# Altium project Einsy_Rambo_0.4a.PrjPcb (part 2 of 2)

## Sheet Heaters.SchDoc: Heaters
size Letter; SheetNumber: 7; SheetTotal: 11
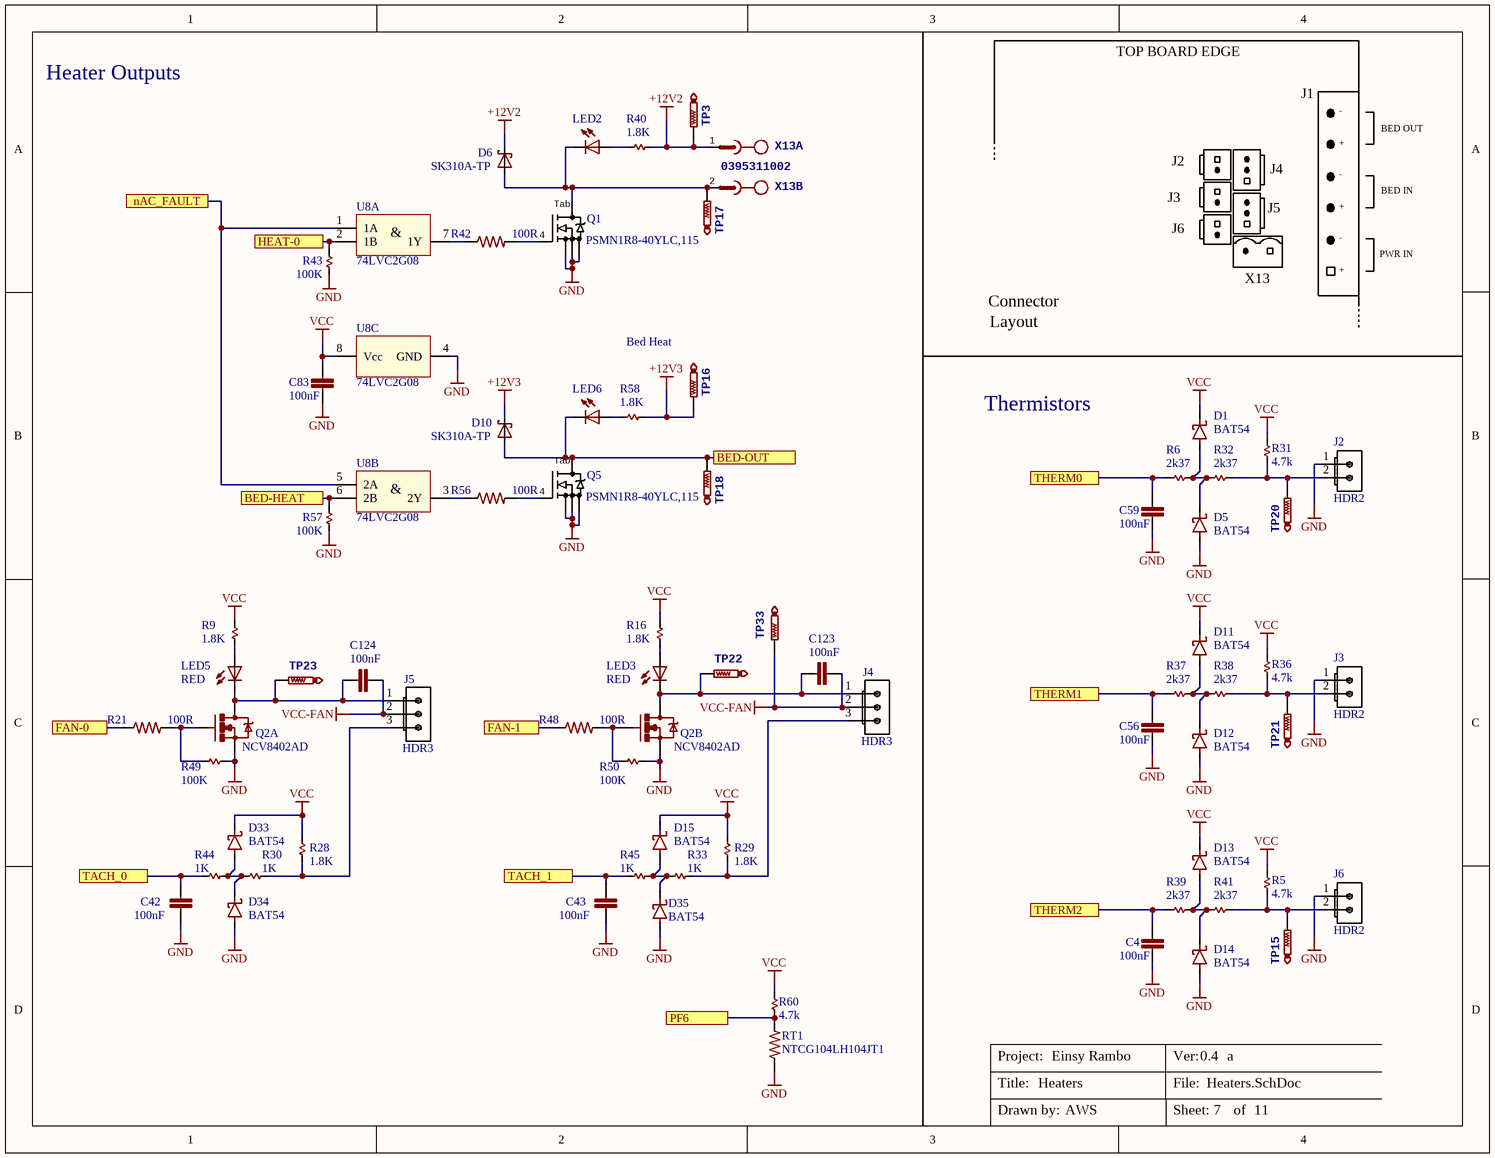
[diagram p6: Heaters.SchDoc]

### Parts
C4  100nF  [C0402]
C42  100nF  [C0402]
C43  100nF  [C0402]
C56  100nF  [C0402]
C59  100nF  [C0402]
C83  100nF  [C0402]
C123  100nF  [C0402]
C124  100nF  [C0402]
D1  BAT54  [SOD523_IPC]
D5  BAT54  [SOD523_IPC]
D6  SK310A-TP  [SMA-SM]
D10  SK310A-TP  [SMA-SM]
D11  BAT54  [SOD523_IPC]
D12  BAT54  [SOD523_IPC]
D13  BAT54  [SOD523_IPC]
D14  BAT54  [SOD523_IPC]
D15  BAT54  [SOD523_IPC]
D33  BAT54  [SOD523_IPC]
D34  BAT54  [SOD523_IPC]
D35  BAT54  [SOD523_IPC]
J2  value HDR2  [70543-02 PIN-IN-PASTE]  (hidden comment: CONN 2PIN VERT 0.1" SHRD LOCKING)
J3  value HDR2  [70543-02 PIN-IN-PASTE]  (hidden comment: CONN 2PIN VERT 0.1" SHRD LOCKING)
J4  value HDR3  [70543-03 PIN-IN-PASTE]  (hidden comment: Molex 70543-03)
J5  value HDR3  [70543-03 PIN-IN-PASTE]  (hidden comment: Molex 70543-03)
J6  value HDR2  [70543-02 PIN-IN-PASTE]  (hidden comment: CONN 2PIN VERT 0.1" SHRD LOCKING)
LED2  RED  [LED2012120]  (value not drawn)
LED3  RED  [LED2012120]
LED5  RED  [LED2012120]
LED6  RED  [LED2012120]  (value not drawn)
Q1  PSMN1R8-40YLC,115  [SOT669_ClosedBotVias]
Q2  NCV8402AD  [NCV8402AD-SOIC8]  (parts A,B of 2)
Q5  PSMN1R8-40YLC,115  [SOT669_ClosedBotVias]
R5  4.7k  [R0402]
R6  2k37  [R0402]
R9  1.8K  [R0402]
R16  1.8K  [R0402]
R21  100R  [R0402]
R28  1.8K  [R0402]
R29  1.8K  [R0402]
R30  1K  [R0402]
R31  4.7k  [R0402]
R32  2k37  [R0402]
R33  1K  [R0402]
R36  4.7k  [R0402]
R37  2k37  [R0402]
R38  2k37  [R0402]
R39  2k37  [R0402]
R40  1.8K  [R0402]
R41  2k37  [R0402]
R42  100R  [R0402]
R43  100K  [R0402]
R44  1K  [R0402]
R45  1K  [R0402]
R48  100R  [R0402]
R49  100K  [R0402]
R50  100K  [R0402]
R56  100R  [R0402]
R57  100K  [R0402]
R58  1.8K  [R0402]
R60  4.7k  [R0402]
RT1  NTCG104LH104JT1  [R0402]
TP3  TestPoint  [TP1-27]  (value not drawn)  (no BOM)
TP15  TestPoint  [TP1-27]  (value not drawn)  (no BOM)
TP16  TestPoint  [TP1-27]  (value not drawn)  (no BOM)
TP17  TestPoint  [TP1-27]  (value not drawn)  (no BOM)
TP18  TestPoint  [TP1-27]  (value not drawn)  (no BOM)
TP20  TestPoint  [TP1-27]  (value not drawn)  (no BOM)
TP21  TestPoint  [TP1-27]  (value not drawn)  (no BOM)
TP22  TestPoint  [TP1-27]  (value not drawn)  (no BOM)
TP23  TestPoint  [TP1-27]  (value not drawn)  (no BOM)
TP33  TestPoint  [TP1-27]  (value not drawn)  (no BOM)
U8  74LVC2G08  [VSSOP8]  (parts A,B,C of 3)
X13  0395311002  [MSTBV2]  (parts A,B of 2)

### Ports
BED-HEAT, BED-OUT, FAN-0, FAN-1, HEAT-0, nAC_FAULT, PF6, TACH_0, TACH_1, THERM0, THERM1, THERM2

### Nets
+12V2: D6.C R40.1 TP3.TP X13.1
+12V3: D10.C R58.1 TP16.TP
GND: C4.2 C42.2 C43.2 C56.2 C59.2 C83.2 D5.A D12.A D14.A D34.A D35.A J2.1(S) J3.1(S) J6.1(S) Q1.1(S) Q1.2(S) Q1.3(S) Q2.1(S) Q2.3(S) Q5.1(S) Q5.2(S) Q5.3(S) R43.1 R49.2 R50.2 R57.1 RT1.1 U8.4(GND)
VCC: C83.1 D1.K D11.K D13.K D15.K D33.K R5.2 R9.1 R16.1 R28.2 R29.2 R31.2 R36.2 R60.2 U8.8(Vcc)
VCC-FAN: C123.2 C124.2 J4.2(S) J5.2(S) TP33.TP
BED-HEAT: R57.2 U8.6(2B) ; port BED-HEAT
BED-OUT: D10.A LED6.C Q5.TAB(D) TP18.TP ; port BED-OUT
FAN-0: R21.1 ; port FAN-0
FAN-1: R48.1 ; port FAN-1
HEAT-0: R43.2 U8.2(1B) ; port HEAT-0
nAC_FAULT: U8.1(1A) U8.5(2A) ; port nAC_FAULT
PF6: R60.1 RT1.2 ; port PF6
TACH_0: C42.1 R44.1 ; port TACH_0
TACH_1: C43.1 R45.1 ; port TACH_1
THERM0: C59.1 R6.2 ; port THERM0
THERM1: C56.1 R37.2 ; port THERM1
THERM2: C4.1 R39.2 ; port THERM2
NetC123_1: C123.1 J4.1(S) LED3.C Q2.5(D) TP22.TP
NetC124_1: C124.1 J5.1(S) LED5.C Q2.7(D) TP23.TP
NetD1_A: D1.A D5.K R6.1 R32.2
NetD6_A: D6.A LED2.C Q1.TAB(D) TP17.TP X13.2
NetD11_A: D11.A D12.K R37.1 R38.2
NetD13_A: D13.A D14.K R39.1 R41.2
NetD15_A: D15.A D35.K R33.1 R45.2
NetD33_A: D33.A D34.K R30.1 R44.2
NetJ2_2: J2.2(S) R31.1 R32.1 TP20.TP
NetJ3_2: J3.2(S) R36.1 R38.1 TP21.TP
NetJ4_3: J4.3(S) R29.1 R33.2
NetJ5_3: J5.3(S) R28.1 R30.2
NetJ6_2: J6.2(S) R5.1 R41.1 TP15.TP
NetLED2_A: LED2.A R40.2
NetLED3_A: LED3.A R16.2
NetLED5_A: LED5.A R9.2
NetLED6_A: LED6.A R58.2
NetQ1_4: Q1.4(G) R42.2
NetQ2_2: Q2.2(G) R21.2 R49.1
NetQ2_4: Q2.4(G) R48.2 R50.1
NetQ5_4: Q5.4(G) R56.2
NetR42_1: R42.1 U8.7(1Y)
NetR56_1: R56.1 U8.3(2Y)

Not connected (* = marked no-connect by the designer): U8 23(NC)

### Notes on the sheet
- Heater Outputs
- TOP BOARD EDGE
- J1
- J2
- +
- -
- BED OUT
- J3
- J6
- J5
- J4
- BED IN
- X13
- PWR IN
- Bed Heat
- Connector
- Layout
- Thermistors
- Title:
- Project:
- File:
- Ver:
- Drawn by:
- Sheet:
- of
- (in symbol 74LVC2G08, part A) &
- (in symbol 74LVC2G08, part B) &
- (in symbol PSMN1R8-40YLC_ClosedBotVias) Tab

### Library data of the parts
C4 C42 C43 C56 C59 C83 C123 C124 = GRM155R71C104KA88D: as C17 on sheet Power-SMPS; VALUE: 100nF; MANUFACTURER #: GRM155R71C104KA88D; DISTRIBUTOR #: 490-3261-2-ND; DISTRIBUTOR: Digi-Key; PART: 100nF
D1 D5 D11-D15 D33-D35 = BAT54WT-7: Diode Schottky 30V 100mA Surface Mount SOD-523; Manufacturer: Diodes Incorporated; EE_SPEC: 30V 0.1A; Tolerance: NA; Value: BAT54; MANUFACTURER #: BAT54WT-7; DISTRIBUTOR #: BAT54WT-7DI-ND; DISTRIBUTOR: Digi-Key; PART: BAT54; Part Description: Diode Schottky 30V 100mA Surface Mount SOD-523
D6 D10 = SK310A: DIODE Schottky 3A SMA; Manufacturer: MCC; MANUFACTURER #: SK310A-LTP; Part Description: Diode Schottky 100V 3A Surface Mount DO-214AC (SMA); EE_SPEC: 3A 100V; Tolerance: NA; VALUE: SK310A; DISTRIBUTOR #: SK310A-LTPMSTR-ND; DISTRIBUTOR: Digi-Key; PART: SK310A
J2 J3 J6 = CONN 2PIN VERT 0.1" SHRD LOCKING PIN-IN-PASTE: Connector 2pos; MANUFACTURER: Molex; MANUFACTURER #: 0705430001; PART: 2 Pin Conn; PART DESCRIPTION: 2 Positions Header, Shrouded Connector 0.100" (2.54mm) Through Hole Gold; TOLERANCE: -NA-; DISTRIBUTOR #: WM4800-ND; DISTRIBUTOR: Digikey; EE_SPEC: -NA-
J4 J5 = CONN 3POS VERT 0.1" SHRD LOCKING PIN-IN-PASTE: 3 Positions Header, Shrouded Connector 0.100" (2.54mm) Through Hole Gold; MANUFACTURER #: 0705430002; PART: 3 Pin Conn VERT; TOLERANCE: -NA-; MANUFACTURER: Molex; DISTRIBUTOR #: WM4801-ND; DISTRIBUTOR: Digikey; PART DESCRIPTION: 3 Positions Header, Shrouded Connector 0.100" (2.54mm) Through Hole Gold; EE_SPEC: -NA-
LED2 LED3 LED5 LED6 = 5988110107F: LED 0805 Red; Manufacturer: Dialight; Part Description: Red 635nm LED Indication - Discrete 2.2V 0805 (2012 Metric); EE_SPEC: 2.2V 0.02A; Tolerance: NA; VALUE: RED; DISTRIBUTOR #: 350-2038-2-ND; DISTRIBUTOR: Digi-Key; MANUFACTURER #: 5988110107F; PART: RED
Q1 Q5 = PSMN1R8-40YLC_ClosedBotVias: MOSFET N-CH 40V 100A LFPAK; MANUFACTURER: Nexperia; PART DESCRIPTION: N-Channel 40V 100A (Tc) 272W (Tc) Surface Mount LFPAK56, Power-SO8; TOLERANCE: -NA-; VALUE: N-FET; EE_SPEC: 40V 100A 1.8mOhm; MANUFACTURER #: PSMN1R8-40YLC,115; DISTRIBUTOR #: 1727-1052-2-ND; DISTRIBUTOR: Digikey
Q2 = NCV8402AD: IC DVR LOW SIDE 8-SOIC; MANUFACTURER #: NCV8402ADDR2G; Manufacturer: On Semi; EE_SPEC: 42Vmaz 2A 0.165-Ohm; Tolerance: NA; DISTRIBUTOR #: NCV8402ADDR2GOSTR-ND; DISTRIBUTOR: Digi-Key; PART: NCV8402; Part Description: IC DVR LOW SIDE 8-SOIC; VALUE: NCV8402
R5 R31 R36 R60 = RC0402FR-074K7L: RES SMD 4.7K OHM 1% 1/16W 0402; Manufacturer: Yageo; Part Description: 4.7k Ohm ±1% 0.063W, 1/16W Chip Resistor 0402 (1005 Metric) Moisture Resistant Thick Film; EE_SPEC: 4.7k 1% 0402; Tolerance: +/- 1%; VALUE: 4.7k; MANUFACTURER #: RC0402FR-074K7L; DISTRIBUTOR #: 311-4.7KLRTR-ND; DISTRIBUTOR: Digi-Key; PART: 4.7k
R6 R32 R37-R39 R41 = RC0402FR-072K37L: RES SMD 2.37K OHM 1% 1/16W 0402; Manufacturer: Yageo; Part Description: 2.37k Ohm ±1% 0.063W, 1/16W Chip Resistor 0402 (1005 Metric) Moisture Resistant Thick Film; EE_SPEC: 2.37k 1% 0402; Tolerance: +/- 1%; VALUE: 2k37; MANUFACTURER #: RC0402FR-072K37L; DISTRIBUTOR #: 311-2.37KLRTR-ND; DISTRIBUTOR: Digi-Key; PART: 2.37k
R9 R16 R28 R29 R40 R58 = RC0402FR-071K8L: RES SMD 1.8K OHM 1% 1/16W 0402; Manufacturer: Yageo; Part Description: 1.8k Ohm ±1% 0.063W, 1/16W Chip Resistor 0402 (1005 Metric) Moisture Resistant Thick Film; EE_SPEC: 1.8k 1% 0402; Tolerance: +/- 1%; VALUE: 1.8K; MANUFACTURER #: RC0402FR-071K8L; DISTRIBUTOR #: 311-1.80KLRTR-ND; DISTRIBUTOR: Digi-Key; PART: 1.8k
R21 R42 R48 R56 = RES 100R 0402 1%: RES SMD 100 OHM 1% 1/16W 0402; MANUFACTURER: Yageo; MANUFACTURER #: RC0402FR-07100RL; PART: 100R 1% 0402; PART DESCRIPTION: 100 Ohm ±1% 0.063W, 1/16W Chip Resistor 0402 (1005 Metric) Moisture Resistant Thick Film; VALUE: 100R; DISTRIBUTOR #: 311-100LRTR-ND; DISTRIBUTOR: Digi-Key; TOLERANCE: 1%; EE_SPEC: 100R 1% 0402
R30 R33 R44 R45 = RC0402FR-071KL: RES SMD 1K OHM 1% 1/16W 0402; Manufacturer: Yageo; Part Description: 1k Ohm ±1% 0.063W, 1/16W Chip Resistor 0402 (1005 Metric) Moisture Resistant Thick Film; EE_SPEC: 1k 1% 0402; Tolerance: +/- 1%; VALUE: 1K; MANUFACTURER #: RC0402FR-071KL; DISTRIBUTOR #: 311-1.00KLRTR-ND; DISTRIBUTOR: Digi-Key; PART: 1k
R43 R49 R50 R57 = RC0402FR-07100KL: RES 100K OHM 1% 1/16W 0402; Manufacturer: Yageo; Part Description: 100k Ohm ±1% 0.063W, 1/16W Chip Resistor 0402 (1005 Metric) Moisture Resistant Thick Film; EE_SPEC: 100K 1% 0402; Tolerance: +/- 1%; VALUE: 100K; DISTRIBUTOR #: 311-100KLRTR-ND; DISTRIBUTOR: Digi-Key; MANUFACTURER #: RC0402FR-07100KL; PART: 100K
RT1 = R0402TBD: Resistor; LastRevisionNote: ImportComponents; Published: 23-Apr-2014; Publisher: UltiMachine; LastRevisionDate: 23-Apr-2014; ComponentLink1URL: https://www.google.com/url?q=https%3A%2F%2Fwww.digikey.com%2Fproduct-detail%2Fen%2Ftdk-corporation%2FNTCG104LH104JT1%2F445-174317-2-ND%2F5872764&sa=D&sntz=1&usg=AFQjCNGfH4No7NyCrDfuMv9mRRvIOcXeQg; ManufacturerPartNumber: NTCG104LH104JT1; VALUE: NTCG104LH104JT1
TP3 TP15-TP18 TP20-TP23 TP33 = TestPoint: Test Point
U8 = 74LVC2G08: IC GATE AND 2CH 2-INP 8-VSSOP; MANUFACTURER #: 74LVC2G08DC,125; MANUFACTURER: Nexperia; PART DESCRIPTION: AND Gate IC 2 Channel 8-VSSOP, US8; TOLERANCE: -NA-; EE_SPEC: 1.65-5.5V, 32mA, LVTTL; VALUE: -NA-; DISTRIBUTOR #: 1727-3560-2-ND; DISTRIBUTOR: Digikey; PART: 74LVC2G08
X13 = 0395311002: Conn - 5.08mm Pitch Fixed; Manufacturer: Molex; PART: 2POS; Part Description: 2 Position Terminal Block Header, Male Pins, Shrouded (4 Side) 0.200" (5.08mm) Vertical Through Hole; EE_SPEC: 300V 15A 0.2"; Tolerance: NA; Value: 0395311002; DISTRIBUTOR #: WM7837-ND; DISTRIBUTOR: Digi-Key; MANUFACTURER #: 0395311002

## Sheet Motor-X.SchDoc: Motor-X
size Letter; SheetNumber: 8; SheetTotal: 11
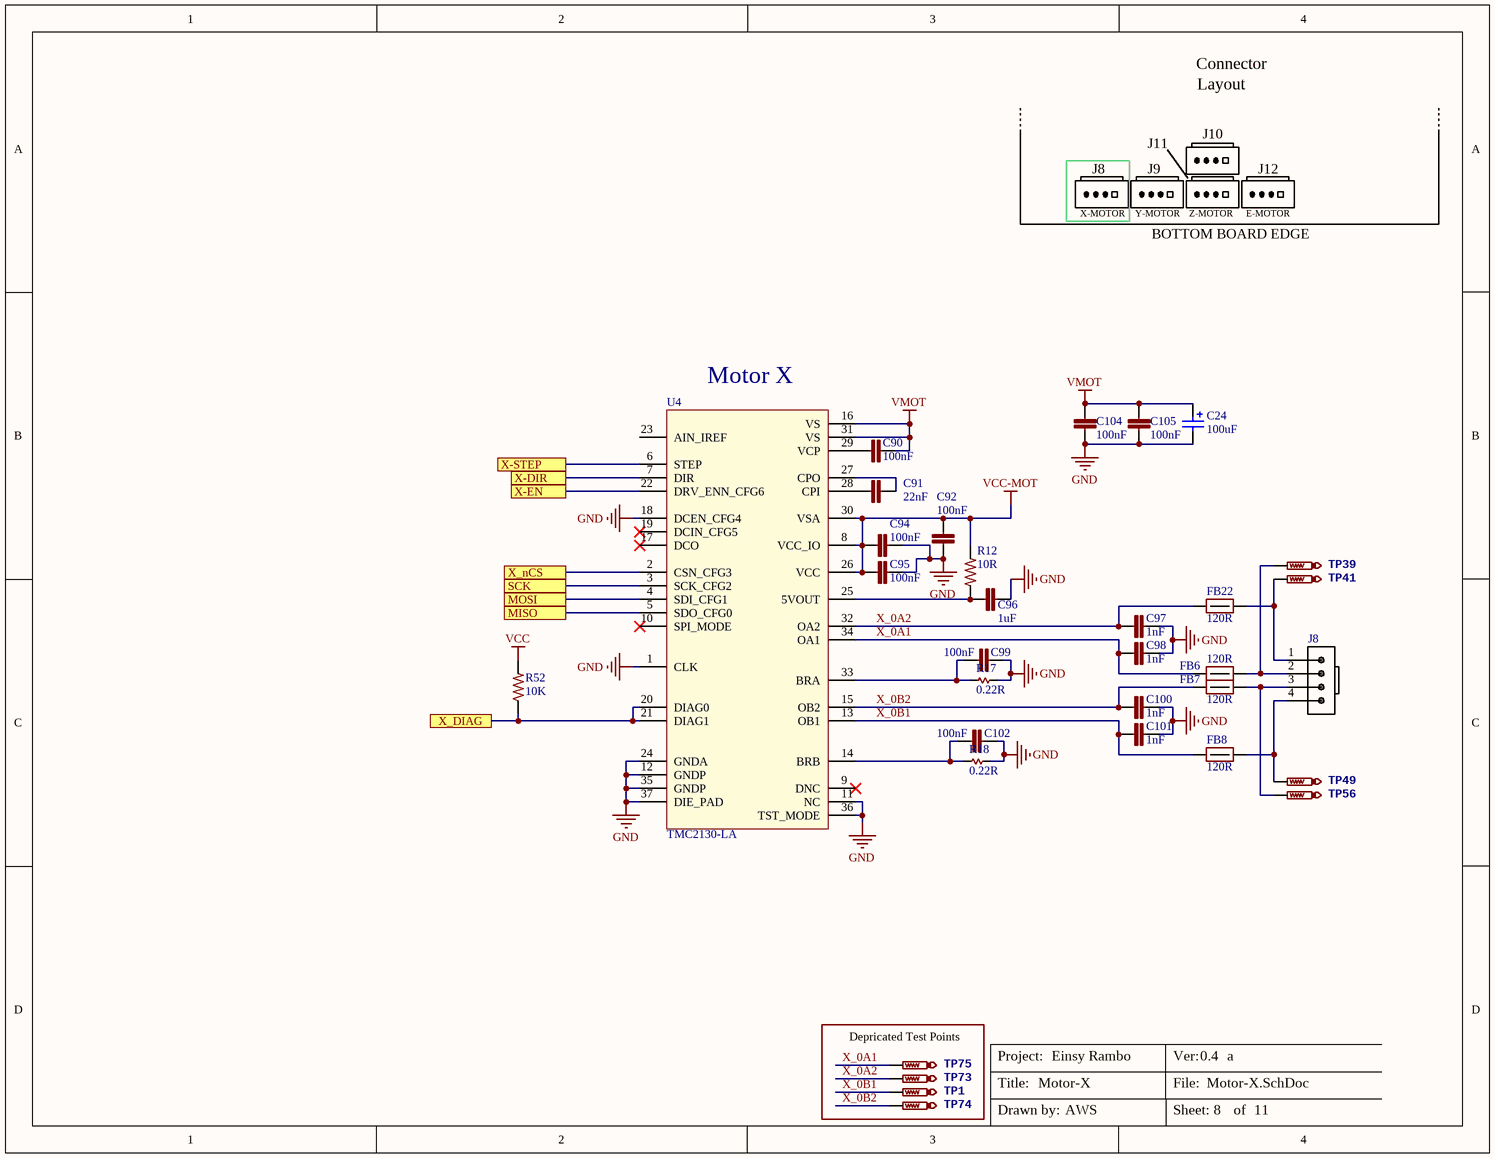
[diagram p7: Motor-X.SchDoc]

### Parts
C24  value 100uF  [CAP-ELEC-063063077]  (hidden comment: UWT1V101MCL1GS)
C90  100nF  [C0603]
C91  22nF  [C0402]
C92  100nF  [C0402]
C94  100nF  [C0402]
C95  100nF  [C0402]
C96  1uF  [C0402]
C97  1nF  [C0603]
C98  1nF  [C0603]
C99  100nF  [C0603]
C100  1nF  [C0603]
C101  1nF  [C0603]
C102  100nF  [C0603]
C104  100nF  [C0603]
C105  100nF  [C0603]
FB6  120R  [FB0603]
FB7  120R  [FB0603]
FB8  120R  [FB0603]
FB22  120R  [FB0603]
J8  Molex 0705430003  [4POL254 PIN-IN-PASTE]  (value not drawn)
R12  10R  [R0402]
R17  0.22R  [R1206]
R18  0.22R  [R1206]
R52  10K  [R0402]
TP1  TestPoint  [TP1-27]  (value not drawn)  (no BOM)
TP39  TestPoint  [TP1-27]  (value not drawn)  (no BOM)
TP41  TestPoint  [TP1-27]  (value not drawn)  (no BOM)
TP49  TestPoint  [TP1-27]  (value not drawn)  (no BOM)
TP56  TestPoint  [TP1-27]  (value not drawn)  (no BOM)
TP73  TestPoint  [TP1-27]  (value not drawn)  (no BOM)
TP74  TestPoint  [TP1-27]  (value not drawn)  (no BOM)
TP75  TestPoint  [TP1-27]  (value not drawn)  (no BOM)
U4  TMC2130-LA  [QFN36-DualSolderMask]

### Blocks framed on the sheet
Depricated Test Points: TP1 TP73-TP75

### Ports
MISO, MOSI, SCK, X-DIR, X-EN, X-STEP, X_DIAG, X_nCS

### Nets
GND: C24.2 C92.1 C94.1 C95.1 C96.2 C97.2 C98.2 C99.1 C100.2 C101.2 C102.1 C104.1 C105.1 R17.2 R18.2 U4.1(CLK) U4.11(NC) U4.12(GNDP) U4.18(DCEN_CFG4) U4.24(GNDA) U4.35(GNDP) U4.36(TST_MODE) U4.37(DIE_PAD)
VCC: R52.2
VCC-MOT: C92.2 C94.2 C95.2 R12.2 U4.8(VCC_IO) U4.26(VCC) U4.30(VSA)
VMOT: C24.1 C90.2 C104.2 C105.2 U4.16(VS) U4.31(VS)
MISO: U4.5(SDO_CFG0) ; port MISO
MOSI: U4.4(SDI_CFG1) ; port MOSI
SCK: U4.3(SCK_CFG2) ; port SCK
X-DIR: U4.7(DIR) ; port X-DIR
X-EN: U4.22(DRV_ENN_CFG6) ; port X-EN
X-STEP: U4.6(STEP) ; port X-STEP
X_0A1: C98.1 FB6.1 TP75.TP U4.34(OA1)
X_0A2: C97.1 FB22.1 TP73.TP U4.32(OA2)
X_0B1: C101.1 FB8.1 TP1.TP U4.13(OB1)
X_0B2: C100.1 FB7.1 TP74.TP U4.15(OB2)
X_DIAG: R52.1 U4.20(DIAG0) U4.21(DIAG1) ; port X_DIAG
X_nCS: U4.2(CSN_CFG3) ; port X_nCS
NetC90_1: C90.1 U4.29(VCP)
NetC91_1: C91.1 U4.28(CPI)
NetC91_2: C91.2 U4.27(CPO)
NetC96_1: C96.1 R12.1 U4.25(5VOUT)
NetC99_2: C99.2 R17.1 U4.33(BRA)
NetC102_2: C102.2 R18.1 U4.14(BRB)
NetFB6_2: FB6.2 J8.2 TP39.TP
NetFB7_2: FB7.2 J8.3 TP56.TP
NetFB8_2: FB8.2 J8.4 TP49.TP
NetFB22_2: FB22.2 J8.1 TP41.TP

Not connected (* = marked no-connect by the designer): U4 9(DNC)* 10(SPI_MODE)* 17(DCO)* 19(DCIN_CFG5)* 23(AIN_IREF)

### Notes on the sheet
- Connector
- Layout
- J11
- J10
- X-MOTOR
- J8
- Y-MOTOR
- J9
- Z-MOTOR
- E-MOTOR
- J12
- BOTTOM BOARD EDGE
- (near U4) Motor X
- Title:
- Project:
- File:
- Ver:
- Drawn by:
- Sheet:
- of

### Library data of the parts
C24 = UWT1V101MCL1GS: CAP ALUM 100UF 35V 20% SMD; Manufacturer: Nichicon; Part Description: 100µF 35V Aluminum Capacitors Radial, Can - SMD 1000 Hrs @ 105°C; EE_SPEC: 100uF 35V Al-El; Tolerance: +/- 20%; MANUFACTURER #: UWT1V101MCL1GS; DISTRIBUTOR #: 493-2203-2-ND; DISTRIBUTOR: Digi-Key; PART: 100uF
C90 C99 C102 C104 C105 = C0603C104K5RACTU: CAP CER 0603 100nF 50V 10% X7R; Manufacturer: Kemet; Part Description: 0.1µF ±10% 50V Ceramic Capacitor X7R 0603 (1608 Metric); EE_SPEC: 100nF 50V X7R 0603; Tolerance: +/- 10%; VALUE: 100nF; MANUFACTURER #: C0603C104K5RACTU; DISTRIBUTOR #: 399-5089-2-ND; DISTRIBUTOR: Digi-Key; PART: 100nF
C91 = GCM155R71H223KA55D: CAP CER 0402 22nF ±10% 50V X7R; Manufacturer: YAGEO; Part Description: 0.022µF ±10% 50V Ceramic Capacitor X7R 0402 (1005 Metric); EE_SPEC: 22nF 50V X7R 0402; Tolerance: +/- 10%; VALUE: 22nF; MANUFACTURER #: GCM155R71H223KA55D; DISTRIBUTOR #: 490-4763-2-ND; DISTRIBUTOR: Digi-Key; PART: 22nF
C92 C94 C95 = GRM155R71C104KA88D: CAP CER 0402 100nF 16V 10% X7R; Manufacturer: Murata; Part Description: 0.10µF ±10% 16V Ceramic Capacitor X7R 0402 (1005 Metric); EE_SPEC: 100nF 16V X7R 0402; Tolerance: +/- 10%; VALUE: 100nF; MANUFACTURER #: GRM155R71C104KA88D; DISTRIBUTOR #: 490-3261-2-ND; DISTRIBUTOR: Digi-Key; PART: 100nF
C96 = GRM155R60J105KE19D: CAP CER 0402 1uF 6.3V 10% X5R; Manufacturer: Murata; Part Description: 1µF ±10% 6.3V Ceramic Capacitor X5R 0402 (1005 Metric); EE_SPEC: 1uF 6.3V X5R 0402; Tolerance: +/- 10%; VALUE: 1uF; MANUFACTURER #: GRM155R60J105KE19D; DISTRIBUTOR #: 490-1320-2-ND; DISTRIBUTOR: Digi-Key; PART: 1uF
C97 C98 C100 C101 = C0603C102K5RACTU: CAP CER 0603  1nF 50v 10% X7R; Manufacturer: Kemet; Part Description: 1000pF ±10% 50V Ceramic Capacitor X7R 0603 (1608 Metric); EE_SPEC: 1nF 50V X7R 0603; Tolerance: +/- 10%; VALUE: 1nF; MANUFACTURER #: C0603C102K5RACTU; DISTRIBUTOR #: 399-1082-2-ND; DISTRIBUTOR: Digi-Key; PART: 1nF
FB6-FB8 FB22 = FERRITE 120R 3A 0603: FERRITE BEAD 120 OHM 0603 1LN; MANUFACTURER: Samsung; MANUFACTURER #: CIS10P121AC; VALUE: 120Rfb; TOLERANCE: -NA-; EE_SPEC: 3A; DISTRIBUTOR #: 1276-6351-2-ND; DISTRIBUTOR: Digikey; PART: FERRITE 120R 3A 0603; PART DESCRIPTION: FERRITE BEAD 120 OHM 0603 1LN
J8 = Molex 0705430003 PIN-IN-PASTE: Molex 4 Pin Clip Connector
R12 = RC0402FR-0710RL: RES SMD 10 OHM 1% 1/16W 0402; Manufacturer: Yageo; Part Description: 10 Ohm ±1% 0.063W, 1/16W Chip Resistor 0402 (1005 Metric) Moisture Resistant Thick Film; EE_SPEC: 10R 1% 0402; Tolerance: +/- 1%; VALUE: 10R; MANUFACTURER #: RC0402FR-0710RL; DISTRIBUTOR #: 311-10.0LRTR-ND; DISTRIBUTOR: Digi-Key; PART: 10R
R17 R18 = 0.22R 1% 1206: RES SMD 0.22 OHM 1% 1/3W 1206; Manufacturer: Panasonic; MANUFACTURER #: RUT3216FR220CS; Tolerance: +/- 1%; DISTRIBUTOR #: RUT3216FR220CS; DISTRIBUTOR: Digi-Key; EE_SPEC: 0.22R 1% 1206; PART: 0.22R; Part Description: RES SMD 0.22 OHM 1% 1/3W 1206; VALUE: 0.22R
R52 = RC0402FR-0710KP: RES SMD 10K OHM 1% 1/16W 0402; MANUFACTURER: Yageo; PART: 10k 1% 0402; PART DESCRIPTION: 10k Ohm ±1% 0.063W, 1/16W Chip Resistor 0402 (1005 Metric) Moisture Resistant Thick Film; EE_SPEC: 10k 1% 0402 1/16W; VALUE: 10K; MANUFACTURER #: RC0402FR-0710KP; DISTRIBUTOR #: YAG1249TR-ND; DISTRIBUTOR: Digi-Key; TOLERANCE: 1%
TP1 TP39 TP41 TP49 TP56 TP73-TP75 = TestPoint: Test Point
U4 = TMC2130-DualSolderMask: IC STEPPER MOTOR DVR SPI 36QFN; MANUFACTURER #: TMC2130-LA-T; Manufacturer: Trinamic; Part Description: Bipolar Motor Driver Power MOSFET SPI, Step/Direction 36-QFN (5x6); EE_SPEC: 46V 1.2A 1/256 Step; Tolerance: NA; DISTRIBUTOR #: 1460-1130-2-ND; DISTRIBUTOR: Digi-Key; PART: TMC2130; VALUE: TMC2130

## Sheet Motor-Y.SchDoc: Motor-Y
size Letter; SheetNumber: 9; SheetTotal: 11
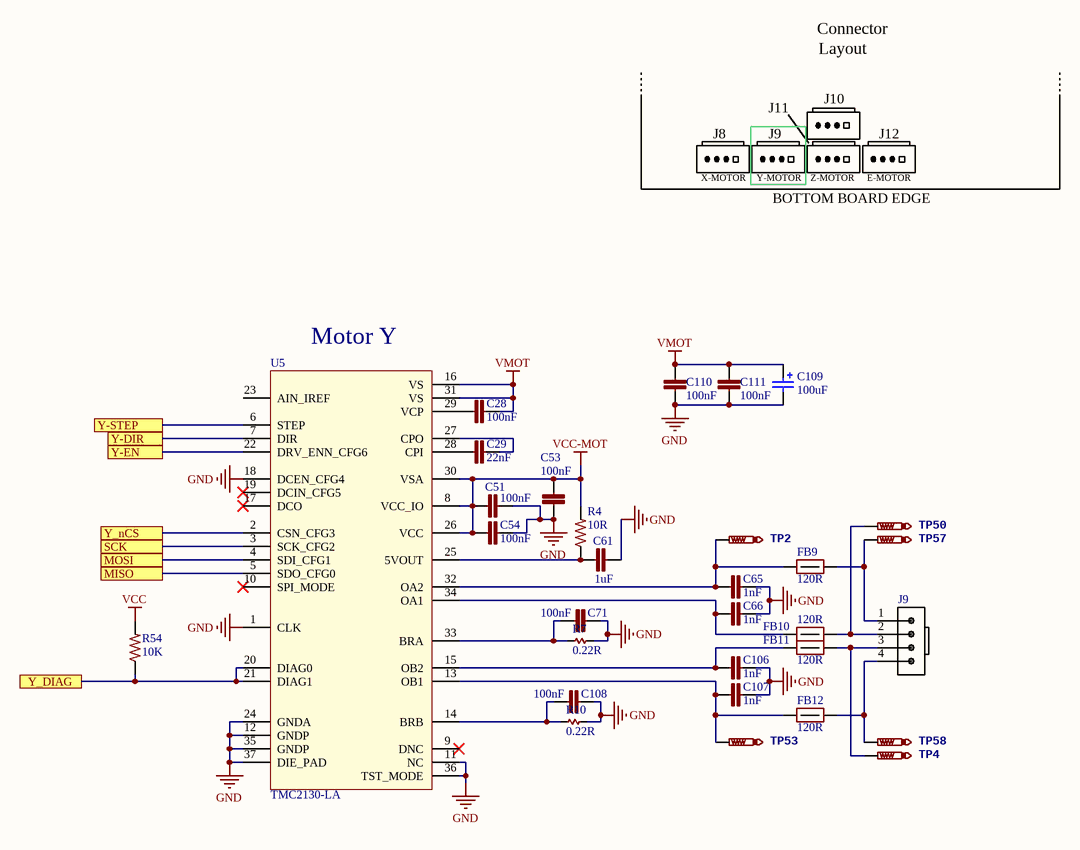
[diagram p8: Motor-Y.SchDoc]

### Parts
C28  100nF  [C0603]
C29  22nF  [C0402]
C51  100nF  [C0402]
C53  100nF  [C0402]
C54  100nF  [C0402]
C61  1uF  [C0402]
C65  1nF  [C0603]
C66  1nF  [C0603]
C71  100nF  [C0603]
C106  1nF  [C0603]
C107  1nF  [C0603]
C108  100nF  [C0603]
C109  value 100uF  [CAP-ELEC-063063077]  (hidden comment: UWT1V101MCL1GS)
C110  100nF  [C0603]
C111  100nF  [C0603]
FB9  120R  [FB0603]
FB10  120R  [FB0603]
FB11  120R  [FB0603]
FB12  120R  [FB0603]
J9  Molex 0705430003  [4POL254 PIN-IN-PASTE]  (value not drawn)
R4  10R  [R0402]
R7  0.22R  [R1206]
R10  0.22R  [R1206]
R54  10K  [R0402]
TP2  TestPoint  [TP1-27]  (value not drawn)  (no BOM)
TP4  TestPoint  [TP1-27]  (value not drawn)  (no BOM)
TP50  TestPoint  [TP1-27]  (value not drawn)  (no BOM)
TP53  TestPoint  [TP1-27]  (value not drawn)  (no BOM)
TP57  TestPoint  [TP1-27]  (value not drawn)  (no BOM)
TP58  TestPoint  [TP1-27]  (value not drawn)  (no BOM)
U5  TMC2130-LA  [QFN36-DualSolderMask]

### Ports
MISO, MOSI, SCK, Y-DIR, Y-EN, Y-STEP, Y_DIAG, Y_nCS

### Nets
GND: C51.1 C53.1 C54.1 C61.2 C65.2 C66.2 C71.1 C106.2 C107.2 C108.1 C109.2 C110.1 C111.1 R7.2 R10.2 U5.1(CLK) U5.11(NC) U5.12(GNDP) U5.18(DCEN_CFG4) U5.24(GNDA) U5.35(GNDP) U5.36(TST_MODE) U5.37(DIE_PAD)
VCC: R54.2
VCC-MOT: C51.2 C53.2 C54.2 R4.2 U5.8(VCC_IO) U5.26(VCC) U5.30(VSA)
VMOT: C28.2 C109.1 C110.2 C111.2 U5.16(VS) U5.31(VS)
MISO: U5.5(SDO_CFG0) ; port MISO
MOSI: U5.4(SDI_CFG1) ; port MOSI
SCK: U5.3(SCK_CFG2) ; port SCK
Y-DIR: U5.7(DIR) ; port Y-DIR
Y-EN: U5.22(DRV_ENN_CFG6) ; port Y-EN
Y-STEP: U5.6(STEP) ; port Y-STEP
Y_DIAG: R54.1 U5.20(DIAG0) U5.21(DIAG1) ; port Y_DIAG
Y_nCS: U5.2(CSN_CFG3) ; port Y_nCS
NetC28_1: C28.1 U5.29(VCP)
NetC29_1: C29.1 U5.28(CPI)
NetC29_2: C29.2 U5.27(CPO)
NetC61_1: C61.1 R4.1 U5.25(5VOUT)
NetC65_1: C65.1 FB9.1 TP2.TP U5.32(OA2)
NetC66_1: C66.1 FB10.1 U5.34(OA1)
NetC71_2: C71.2 R7.1 U5.33(BRA)
NetC106_1: C106.1 FB11.1 U5.15(OB2)
NetC107_1: C107.1 FB12.1 TP53.TP U5.13(OB1)
NetC108_2: C108.2 R10.1 U5.14(BRB)
NetFB9_2: FB9.2 J9.1 TP57.TP
NetFB10_2: FB10.2 J9.2 TP50.TP
NetFB11_2: FB11.2 J9.3 TP4.TP
NetFB12_2: FB12.2 J9.4 TP58.TP

Not connected (* = marked no-connect by the designer): U5 9(DNC)* 10(SPI_MODE)* 17(DCO)* 19(DCIN_CFG5)* 23(AIN_IREF)

### Notes on the sheet
- Connector
- Layout
- J8
- J9
- J11
- J10
- J12
- X-MOTOR
- Y-MOTOR
- BOTTOM BOARD EDGE
- Z-MOTOR
- E-MOTOR
- (near U5) Motor Y
- Title:
- Project:
- File:
- Ver:
- Drawn by:
- Sheet:
- of

### Library data of the parts
C28 C71 C108 C110 C111 = C0603C104K5RACTU: as C90 on sheet Motor-X; VALUE: 100nF; MANUFACTURER #: C0603C104K5RACTU; DISTRIBUTOR #: 399-5089-2-ND; DISTRIBUTOR: Digi-Key; PART: 100nF
C29 = GCM155R71H223KA55D: as C91 on sheet Motor-X; VALUE: 22nF; MANUFACTURER #: GCM155R71H223KA55D; DISTRIBUTOR #: 490-4763-2-ND; DISTRIBUTOR: Digi-Key; PART: 22nF
C51 C53 C54 = GRM155R71C104KA88D: as C92 on sheet Motor-X; VALUE: 100nF; MANUFACTURER #: GRM155R71C104KA88D; DISTRIBUTOR #: 490-3261-2-ND; DISTRIBUTOR: Digi-Key; PART: 100nF
C61 = GRM155R60J105KE19D: as C96 on sheet Motor-X; VALUE: 1uF; MANUFACTURER #: GRM155R60J105KE19D; DISTRIBUTOR #: 490-1320-2-ND; DISTRIBUTOR: Digi-Key; PART: 1uF
C65 C66 C106 C107 = C0603C102K5RACTU: as C97 on sheet Motor-X; VALUE: 1nF; MANUFACTURER #: C0603C102K5RACTU; DISTRIBUTOR #: 399-1082-2-ND; DISTRIBUTOR: Digi-Key; PART: 1nF
C109 = UWT1V101MCL1GS: as C24 on sheet Motor-X; MANUFACTURER #: UWT1V101MCL1GS; DISTRIBUTOR #: 493-2203-2-ND; DISTRIBUTOR: Digi-Key; PART: 100uF
FB9-FB12 = FERRITE 120R 3A 0603: as FB6-FB8 on sheet Motor-X; DISTRIBUTOR #: 1276-6351-2-ND; DISTRIBUTOR: Digikey; PART: FERRITE 120R 3A 0603; PART DESCRIPTION: FERRITE BEAD 120 OHM 0603 1LN
J9 = Molex 0705430003 PIN-IN-PASTE: Molex 4 Pin Clip Connector
R4 = RC0402FR-0710RL: as R12 on sheet Motor-X; VALUE: 10R; MANUFACTURER #: RC0402FR-0710RL; DISTRIBUTOR #: 311-10.0LRTR-ND; DISTRIBUTOR: Digi-Key; PART: 10R
R7 R10 = 0.22R 1% 1206: as R17 on sheet Motor-X; DISTRIBUTOR #: RUT3216FR220CS; DISTRIBUTOR: Digi-Key; EE_SPEC: 0.22R 1% 1206; PART: 0.22R; Part Description: RES SMD 0.22 OHM 1% 1/3W 1206; VALUE: 0.22R
R54 = RC0402FR-0710KP: as R52 on sheet Motor-X; VALUE: 10K; MANUFACTURER #: RC0402FR-0710KP; DISTRIBUTOR #: YAG1249TR-ND; DISTRIBUTOR: Digi-Key; TOLERANCE: 1%
TP2 TP4 TP50 TP53 TP57 TP58 = TestPoint: Test Point
U5 = TMC2130-DualSolderMask: as U4 on sheet Motor-X; DISTRIBUTOR #: 1460-1130-2-ND; DISTRIBUTOR: Digi-Key; PART: TMC2130; VALUE: TMC2130

## Sheet Motor-Z.SchDoc: Motor-Z
size Letter; SheetNumber: 10; SheetTotal: 11
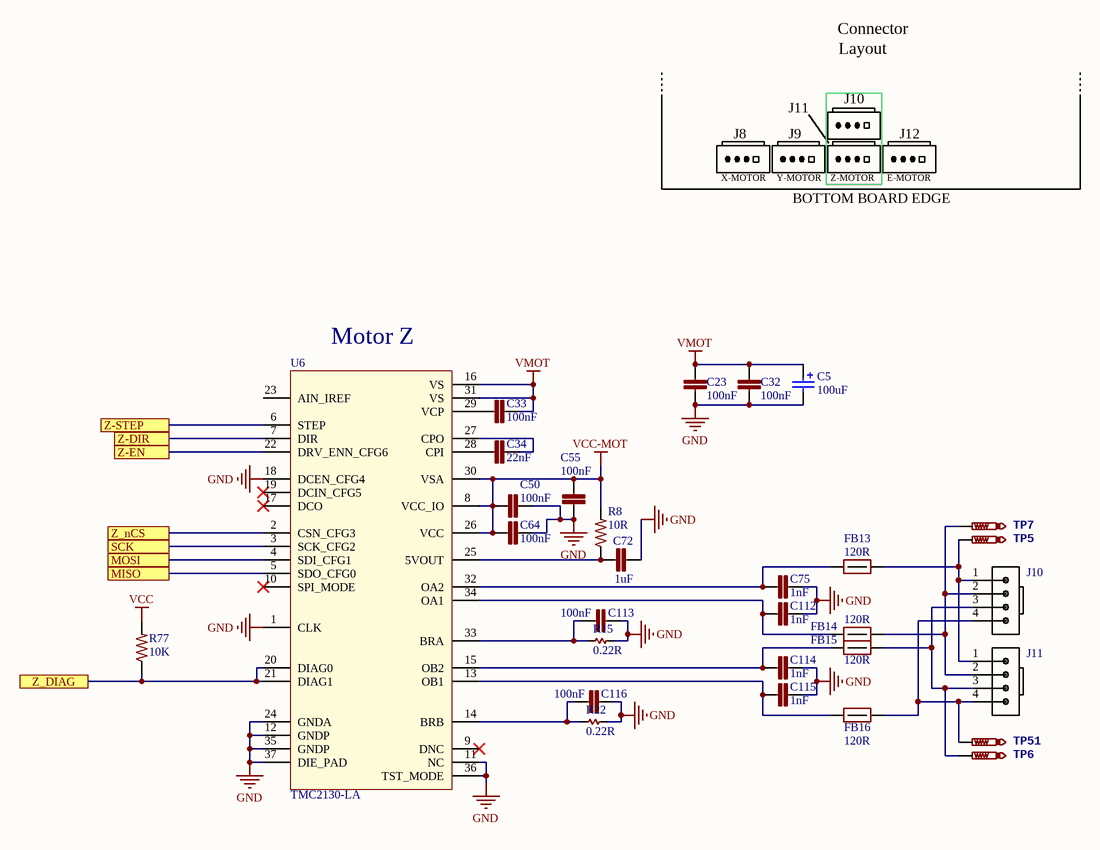
[diagram p9: Motor-Z.SchDoc]

### Parts
C5  value 100uF  [CAP-ELEC-063063077]  (hidden comment: UWT1V101MCL1GS)
C23  100nF  [C0603]
C32  100nF  [C0603]
C33  100nF  [C0603]
C34  22nF  [C0402]
C50  100nF  [C0402]
C55  100nF  [C0402]
C64  100nF  [C0402]
C72  1uF  [C0402]
C75  1nF  [C0603]
C112  1nF  [C0603]
C113  100nF  [C0603]
C114  1nF  [C0603]
C115  1nF  [C0603]
C116  100nF  [C0603]
FB13  120R  [FB0603]
FB14  120R  [FB0603]
FB15  120R  [FB0603]
FB16  120R  [FB0603]
J10  Molex 0705430003  [4POL254 PIN-IN-PASTE]  (value not drawn)
J11  Molex 0705430003  [4POL254 PIN-IN-PASTE]  (value not drawn)
R8  10R  [R0402]
R15  0.22R  [R1206]
R22  0.22R  [R1206]
R77  10K  [R0402]
TP5  TestPoint  [TP1-27]  (value not drawn)  (no BOM)
TP6  TestPoint  [TP1-27]  (value not drawn)  (no BOM)
TP7  TestPoint  [TP1-27]  (value not drawn)  (no BOM)
TP51  TestPoint  [TP1-27]  (value not drawn)  (no BOM)
U6  TMC2130-LA  [QFN36-DualSolderMask]

### Ports
MISO, MOSI, SCK, Z-DIR, Z-EN, Z-STEP, Z_DIAG, Z_nCS

### Nets
GND: C5.2 C23.1 C32.1 C50.1 C55.1 C64.1 C72.2 C75.2 C112.2 C113.1 C114.2 C115.2 C116.1 R15.2 R22.2 U6.1(CLK) U6.11(NC) U6.12(GNDP) U6.18(DCEN_CFG4) U6.24(GNDA) U6.35(GNDP) U6.36(TST_MODE) U6.37(DIE_PAD)
VCC: R77.2
VCC-MOT: C50.2 C55.2 C64.2 R8.2 U6.8(VCC_IO) U6.26(VCC) U6.30(VSA)
VMOT: C5.1 C23.2 C32.2 C33.2 U6.16(VS) U6.31(VS)
MISO: U6.5(SDO_CFG0) ; port MISO
MOSI: U6.4(SDI_CFG1) ; port MOSI
SCK: U6.3(SCK_CFG2) ; port SCK
Z-DIR: U6.7(DIR) ; port Z-DIR
Z-EN: U6.22(DRV_ENN_CFG6) ; port Z-EN
Z-STEP: U6.6(STEP) ; port Z-STEP
Z_DIAG: R77.1 U6.20(DIAG0) U6.21(DIAG1) ; port Z_DIAG
Z_nCS: U6.2(CSN_CFG3) ; port Z_nCS
NetC33_1: C33.1 U6.29(VCP)
NetC34_1: C34.1 U6.28(CPI)
NetC34_2: C34.2 U6.27(CPO)
NetC72_1: C72.1 R8.1 U6.25(5VOUT)
NetC75_1: C75.1 FB13.1 U6.32(OA2)
NetC112_1: C112.1 FB14.1 U6.34(OA1)
NetC113_2: C113.2 R15.1 U6.33(BRA)
NetC114_1: C114.1 FB15.1 U6.15(OB2)
NetC115_1: C115.1 FB16.1 U6.13(OB1)
NetC116_2: C116.2 R22.1 U6.14(BRB)
NetFB13_2: FB13.2 J10.1 J11.1 TP5.TP
NetFB14_2: FB14.2 J10.2 J11.2 TP7.TP
NetFB15_2: FB15.2 J10.3 J11.3 TP6.TP
NetFB16_2: FB16.2 J10.4 J11.4 TP51.TP

Not connected (* = marked no-connect by the designer): U6 9(DNC)* 10(SPI_MODE)* 17(DCO)* 19(DCIN_CFG5)* 23(AIN_IREF)

### Notes on the sheet
- Connector
- Layout
- J8
- J9
- J11
- J10
- J12
- X-MOTOR
- Y-MOTOR
- BOTTOM BOARD EDGE
- Z-MOTOR
- E-MOTOR
- (near U6) Motor Z
- Title:
- Project:
- File:
- Ver:
- Drawn by:
- Sheet:
- of

### Library data of the parts
C5 = UWT1V101MCL1GS: as C24 on sheet Motor-X; MANUFACTURER #: UWT1V101MCL1GS; DISTRIBUTOR #: 493-2203-2-ND; DISTRIBUTOR: Digi-Key; PART: 100uF
C23 C32 C33 C113 C116 = C0603C104K5RACTU: as C90 on sheet Motor-X; VALUE: 100nF; MANUFACTURER #: C0603C104K5RACTU; DISTRIBUTOR #: 399-5089-2-ND; DISTRIBUTOR: Digi-Key; PART: 100nF
C34 = GCM155R71H223KA55D: as C91 on sheet Motor-X; VALUE: 22nF; MANUFACTURER #: GCM155R71H223KA55D; DISTRIBUTOR #: 490-4763-2-ND; DISTRIBUTOR: Digi-Key; PART: 22nF
C50 C55 C64 = GRM155R71C104KA88D: as C92 on sheet Motor-X; VALUE: 100nF; MANUFACTURER #: GRM155R71C104KA88D; DISTRIBUTOR #: 490-3261-2-ND; DISTRIBUTOR: Digi-Key; PART: 100nF
C72 = GRM155R60J105KE19D: as C96 on sheet Motor-X; VALUE: 1uF; MANUFACTURER #: GRM155R60J105KE19D; DISTRIBUTOR #: 490-1320-2-ND; DISTRIBUTOR: Digi-Key; PART: 1uF
C75 C112 C114 C115 = C0603C102K5RACTU: as C97 on sheet Motor-X; VALUE: 1nF; MANUFACTURER #: C0603C102K5RACTU; DISTRIBUTOR #: 399-1082-2-ND; DISTRIBUTOR: Digi-Key; PART: 1nF
FB13-FB16 = FERRITE 120R 3A 0603: as FB6-FB8 on sheet Motor-X; DISTRIBUTOR #: 1276-6351-2-ND; DISTRIBUTOR: Digikey; PART: FERRITE 120R 3A 0603; PART DESCRIPTION: FERRITE BEAD 120 OHM 0603 1LN
J10 J11 = Molex 0705430003 PIN-IN-PASTE: Molex 4 Pin Clip Connector
R8 = RC0402FR-0710RL: as R12 on sheet Motor-X; VALUE: 10R; MANUFACTURER #: RC0402FR-0710RL; DISTRIBUTOR #: 311-10.0LRTR-ND; DISTRIBUTOR: Digi-Key; PART: 10R
R15 R22 = 0.22R 1% 1206: as R17 on sheet Motor-X; DISTRIBUTOR #: RUT3216FR220CS; DISTRIBUTOR: Digi-Key; EE_SPEC: 0.22R 1% 1206; PART: 0.22R; Part Description: RES SMD 0.22 OHM 1% 1/3W 1206; VALUE: 0.22R
R77 = RC0402FR-0710KP: as R52 on sheet Motor-X; VALUE: 10K; MANUFACTURER #: RC0402FR-0710KP; DISTRIBUTOR #: YAG1249TR-ND; DISTRIBUTOR: Digi-Key; TOLERANCE: 1%
TP5-TP7 TP51 = TestPoint: Test Point
U6 = TMC2130-DualSolderMask: as U4 on sheet Motor-X; DISTRIBUTOR #: 1460-1130-2-ND; DISTRIBUTOR: Digi-Key; PART: TMC2130; VALUE: TMC2130

## Sheet Motor-E.SchDoc: Motor-E
size Letter; SheetNumber: 11; SheetTotal: 11
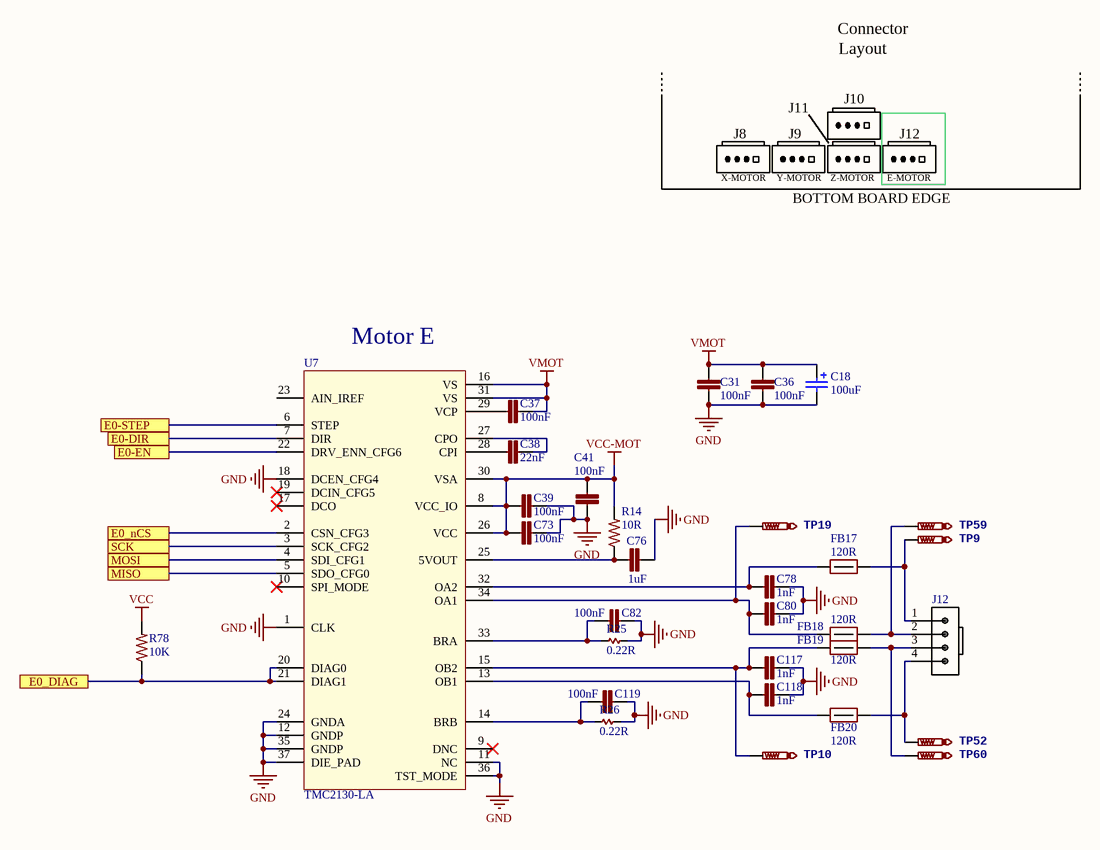
[diagram p10: Motor-E.SchDoc]

### Parts
C18  value 100uF  [CAP-ELEC-063063077]  (hidden comment: UWT1V101MCL1GS)
C31  100nF  [C0603]
C36  100nF  [C0603]
C37  100nF  [C0603]
C38  22nF  [C0402]
C39  100nF  [C0402]
C41  100nF  [C0402]
C73  100nF  [C0402]
C76  1uF  [C0402]
C78  1nF  [C0603]
C80  1nF  [C0603]
C82  100nF  [C0603]
C117  1nF  [C0603]
C118  1nF  [C0603]
C119  100nF  [C0603]
FB17  120R  [FB0603]
FB18  120R  [FB0603]
FB19  120R  [FB0603]
FB20  120R  [FB0603]
J12  Molex 0705430003  [4POL254 PIN-IN-PASTE]  (value not drawn)
R14  10R  [R0402]
R25  0.22R  [R1206]
R26  0.22R  [R1206]
R78  10K  [R0402]
TP9  TestPoint  [TP1-27]  (value not drawn)  (no BOM)
TP10  TestPoint  [TP1-27]  (value not drawn)  (no BOM)
TP19  TestPoint  [TP1-27]  (value not drawn)  (no BOM)
TP52  TestPoint  [TP1-27]  (value not drawn)  (no BOM)
TP59  TestPoint  [TP1-27]  (value not drawn)  (no BOM)
TP60  TestPoint  [TP1-27]  (value not drawn)  (no BOM)
U7  TMC2130-LA  [QFN36-DualSolderMask]

### Ports
E0-DIR, E0-EN, E0-STEP, E0_DIAG, E0_nCS, MISO, MOSI, SCK

### Nets
GND: C18.2 C31.1 C36.1 C39.1 C41.1 C73.1 C76.2 C78.2 C80.2 C82.1 C117.2 C118.2 C119.1 R25.2 R26.2 U7.1(CLK) U7.11(NC) U7.12(GNDP) U7.18(DCEN_CFG4) U7.24(GNDA) U7.35(GNDP) U7.36(TST_MODE) U7.37(DIE_PAD)
VCC: R78.2
VCC-MOT: C39.2 C41.2 C73.2 R14.2 U7.8(VCC_IO) U7.26(VCC) U7.30(VSA)
VMOT: C18.1 C31.2 C36.2 C37.2 U7.16(VS) U7.31(VS)
E0-DIR: U7.7(DIR) ; port E0-DIR
E0-EN: U7.22(DRV_ENN_CFG6) ; port E0-EN
E0-STEP: U7.6(STEP) ; port E0-STEP
E0_DIAG: R78.1 U7.20(DIAG0) U7.21(DIAG1) ; port E0_DIAG
E0_nCS: U7.2(CSN_CFG3) ; port E0_nCS
MISO: U7.5(SDO_CFG0) ; port MISO
MOSI: U7.4(SDI_CFG1) ; port MOSI
SCK: U7.3(SCK_CFG2) ; port SCK
NetC37_1: C37.1 U7.29(VCP)
NetC38_1: C38.1 U7.28(CPI)
NetC38_2: C38.2 U7.27(CPO)
NetC76_1: C76.1 R14.1 U7.25(5VOUT)
NetC78_1: C78.1 FB17.1 U7.32(OA2)
NetC80_1: C80.1 FB18.1 TP19.TP U7.34(OA1)
NetC82_2: C82.2 R25.1 U7.33(BRA)
NetC117_1: C117.1 FB19.1 TP10.TP U7.15(OB2)
NetC118_1: C118.1 FB20.1 U7.13(OB1)
NetC119_2: C119.2 R26.1 U7.14(BRB)
NetFB17_2: FB17.2 J12.1 TP9.TP
NetFB18_2: FB18.2 J12.2 TP59.TP
NetFB19_2: FB19.2 J12.3 TP60.TP
NetFB20_2: FB20.2 J12.4 TP52.TP

Not connected (* = marked no-connect by the designer): U7 9(DNC)* 10(SPI_MODE)* 17(DCO)* 19(DCIN_CFG5)* 23(AIN_IREF)

### Notes on the sheet
- Connector
- Layout
- J8
- J9
- J11
- J10
- J12
- X-MOTOR
- Y-MOTOR
- BOTTOM BOARD EDGE
- Z-MOTOR
- E-MOTOR
- (near U7) Motor E
- Title:
- Project:
- File:
- Ver:
- Drawn by:
- Sheet:
- of

### Library data of the parts
C18 = UWT1V101MCL1GS: as C24 on sheet Motor-X; MANUFACTURER #: UWT1V101MCL1GS; DISTRIBUTOR #: 493-2203-2-ND; DISTRIBUTOR: Digi-Key; PART: 100uF
C31 C36 C37 C82 C119 = C0603C104K5RACTU: as C90 on sheet Motor-X; VALUE: 100nF; MANUFACTURER #: C0603C104K5RACTU; DISTRIBUTOR #: 399-5089-2-ND; DISTRIBUTOR: Digi-Key; PART: 100nF
C38 = GCM155R71H223KA55D: as C91 on sheet Motor-X; VALUE: 22nF; MANUFACTURER #: GCM155R71H223KA55D; DISTRIBUTOR #: 490-4763-2-ND; DISTRIBUTOR: Digi-Key; PART: 22nF
C39 C41 C73 = GRM155R71C104KA88D: as C92 on sheet Motor-X; VALUE: 100nF; MANUFACTURER #: GRM155R71C104KA88D; DISTRIBUTOR #: 490-3261-2-ND; DISTRIBUTOR: Digi-Key; PART: 100nF
C76 = GRM155R60J105KE19D: as C96 on sheet Motor-X; VALUE: 1uF; MANUFACTURER #: GRM155R60J105KE19D; DISTRIBUTOR #: 490-1320-2-ND; DISTRIBUTOR: Digi-Key; PART: 1uF
C78 C80 C117 C118 = C0603C102K5RACTU: as C97 on sheet Motor-X; VALUE: 1nF; MANUFACTURER #: C0603C102K5RACTU; DISTRIBUTOR #: 399-1082-2-ND; DISTRIBUTOR: Digi-Key; PART: 1nF
FB17-FB20 = FERRITE 120R 3A 0603: as FB6-FB8 on sheet Motor-X; DISTRIBUTOR #: 1276-6351-2-ND; DISTRIBUTOR: Digikey; PART: FERRITE 120R 3A 0603; PART DESCRIPTION: FERRITE BEAD 120 OHM 0603 1LN
J12 = Molex 0705430003 PIN-IN-PASTE: Molex 4 Pin Clip Connector
R14 = RC0402FR-0710RL: as R12 on sheet Motor-X; VALUE: 10R; MANUFACTURER #: RC0402FR-0710RL; DISTRIBUTOR #: 311-10.0LRTR-ND; DISTRIBUTOR: Digi-Key; PART: 10R
R25 R26 = 0.22R 1% 1206: as R17 on sheet Motor-X; DISTRIBUTOR #: RUT3216FR220CS; DISTRIBUTOR: Digi-Key; EE_SPEC: 0.22R 1% 1206; PART: 0.22R; Part Description: RES SMD 0.22 OHM 1% 1/3W 1206; VALUE: 0.22R
R78 = RC0402FR-0710KP: as R52 on sheet Motor-X; VALUE: 10K; MANUFACTURER #: RC0402FR-0710KP; DISTRIBUTOR #: YAG1249TR-ND; DISTRIBUTOR: Digi-Key; TOLERANCE: 1%
TP9 TP10 TP19 TP52 TP59 TP60 = TestPoint: Test Point
U7 = TMC2130-DualSolderMask: as U4 on sheet Motor-X; DISTRIBUTOR #: 1460-1130-2-ND; DISTRIBUTOR: Digi-Key; PART: TMC2130; VALUE: TMC2130

## Nets that join several sheets
+12V2: Power-SMPS (5 pins), Connectors (J19.1), Heaters (D6.C R40.1 TP3.TP X13.1)
+12V3: Power-SMPS (7 pins), Heaters (D10.C R58.1 TP16.TP)
FGND: Power-SMPS (8 pins), MCU (S1.3 S1.4), USB-Serial (D16.C)
GND: Power-SMPS (40 pins), MCU (20 pins), USB-Serial (5 pins), Connectors (37 pins), Endstops (9 pins), Heaters (28 pins), Motor-X (23 pins), Motor-Y (23 pins), Motor-Z (23 pins), Motor-E (23 pins)
VCC: Power-SMPS (11 pins), MCU (7 pins), USB-Serial (5 pins), Connectors (20 pins), Endstops (6 pins), Heaters (15 pins), Motor-X (R52.2), Motor-Y (R54.2), Motor-Z (R77.2), Motor-E (R78.2)
VCC-FAN: Power-SMPS (FB23.2), Heaters (5 pins)
VCC-MOT: Power-SMPS (C93.2 FB4.2 TP8.TP), Motor-X (7 pins), Motor-Y (7 pins), Motor-Z (7 pins), Motor-E (7 pins)
VMOT: Power-SMPS (7 pins), Motor-X (6 pins), Motor-Y (6 pins), Motor-Z (6 pins), Motor-E (6 pins)
BED-HEAT: MCU (U2.1), Heaters (R57.2 U8.6)
BED-OUT: Power-SMPS (J1.6), Heaters (D10.A LED6.C Q5.TAB TP18.TP)
BED_MON: Power-SMPS (C79.1 R55.1 R59.1), MCU (U2.88)
E0-DIR: MCU (U2.41), Motor-E (U7.7)
E0-EN: MCU (U2.74), Motor-E (U7.22)
E0-STEP: MCU (U2.56), Motor-E (U7.6)
E0_DIAG: MCU (U2.86), Motor-E (R78.1 U7.20 U7.21)
E0_nCS: MCU (U2.85), Motor-E (U7.2)
FAN-0: MCU (U2.17), Heaters (R21.1)
FAN-1: MCU (U2.15), Heaters (R48.1)
HEAT-0: MCU (U2.7), Heaters (R43.2 U8.2)
MISO: MCU (U2.22), Connectors (J19.9 R19.1 TP34.TP U14.4), Motor-X (U4.5), Motor-Y (U5.5), Motor-Z (U6.5), Motor-E (U7.5)
MOSI: MCU (RV8.2), Connectors (J19.12 P2.5 TP36.TP U12.2), Motor-X (U4.4), Motor-Y (U5.4), Motor-Z (U6.4), Motor-E (U7.4)
nAC_FAULT: MCU (U2.6), Connectors (J19.3 R68.1 R69.2 RV27.2), Heaters (U8.1 U8.5)
nRESET: MCU (6 pins), Connectors (P2.3 Q3.3 TP37.TP)
PC5: MCU (U2.58), Connectors (R83.2 U12.9)
PD5: MCU (U2.48), Connectors (FB27.2)
PE3: MCU (U2.5), Connectors (FB37.2)
PF5: MCU (U2.92), Connectors (FB28.1)
PF6: MCU (U2.91), Heaters (R60.1 RT1.2)
PF7: MCU (U2.90), Connectors (FB26.1)
PG3: MCU (U2.28), Connectors (FB31.2)
PG4: MCU (U2.29), Connectors (FB29.2)
PH2: MCU (U2.14), Connectors (FB24.1)
PH6: MCU (U2.18), Connectors (FB25.2)
PH7: MCU (U2.27), Connectors (FB30.1)
PJ2: MCU (U2.65), Connectors (FB33.1)
PJ3: MCU (U2.66), Connectors (J19.7)
PJ5: MCU (U2.68), Connectors (P3.9)
PK0: MCU (U2.89), Connectors (P3.10)
PROC_nCS: MCU (R34.1), Connectors (J19.5)
PWR_MON: Power-SMPS (C121.1 R53.1 R66.1), MCU (U2.93)
RST-IO: MCU (C10.1), USB-Serial (TP29.TP U10.14)
RX0: MCU (U2.2), USB-Serial (TP30.TP U10.12)
RX1: MCU (U2.45), Connectors (J19.6 P4.4 R86.1 R87.2)
RX2: MCU (U2.12), Connectors (P3.5)
RX3: MCU (U2.63), Connectors (FB36.1)
SCK: MCU (RV18.2), Connectors (J19.11 P2.9 TP55.TP U12.5), Motor-X (U4.3), Motor-Y (U5.3), Motor-Z (U6.3), Motor-E (U7.3)
SCL: MCU (R61.1 U2.43), Connectors (P3.6)
SD_SS: MCU (U2.69), Connectors (FB34.2)
SDA: MCU (R51.1 U2.44), Connectors (P3.8)
TACH_0: MCU (U2.8), Heaters (C42.1 R44.1)
TACH_1: MCU (U2.9), Heaters (C43.1 R45.1)
THERM0: MCU (U2.97), Heaters (C59.1 R6.2)
THERM1: MCU (U2.96), Heaters (C56.1 R37.2)
THERM2: MCU (U2.95), Heaters (C4.1 R39.2)
TX0: MCU (U2.3), USB-Serial (TP31.TP U10.11)
TX1: MCU (U2.46), Connectors (R80.1 R85.1)
TX2: MCU (U2.13), Connectors (R67.1)
TX3: MCU (U2.64), Connectors (FB35.1)
X-DIR: MCU (U2.35), Motor-X (U4.7)
X-EN: MCU (U2.71), Motor-X (U4.22)
X-STEP: MCU (U2.53), Motor-X (U4.6)
X_DIAG: MCU (U2.87), Motor-X (R52.1 U4.20 U4.21)
X_MIN: MCU (U2.25), Endstops (R74.1 RV3.2)
X_nCS: MCU (U2.51), Motor-X (U4.2)
XTRA_0: MCU (U2.49), USB-Serial (TP11.TP U10.13)
Y-DIR: MCU (U2.36), Motor-Y (U5.7)
Y-EN: MCU (U2.72), Motor-Y (U5.22)
Y-STEP: MCU (U2.54), Motor-Y (U5.6)
Y_DIAG: MCU (U2.82), Motor-Y (R54.1 U5.20 U5.21)
Y_MIN: MCU (U2.24), Endstops (R75.1 RV5.2)
Y_nCS: MCU (U2.70), Motor-Y (U5.2)
Z-DIR: MCU (U2.37), Motor-Z (U6.7)
Z-EN: MCU (U2.73), Motor-Z (U6.22)
Z-STEP: MCU (U2.55), Motor-Z (U6.6)
Z_DIAG: MCU (U2.83), Motor-Z (R77.1 U6.20 U6.21)
Z_MIN: MCU (U2.23), Endstops (R76.1)
Z_nCS: MCU (U2.84), Motor-Z (U6.2)
Z_THERM: MCU (U2.94), Endstops (C77.1 R63.2)